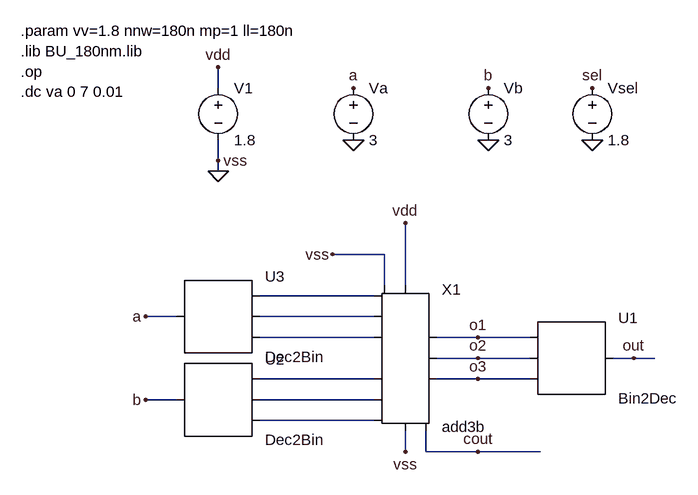
[diagram p0: schematic add3b_test.asc]
add3b_test.asc, the LTspice schematic file:
Version 4
SHEET 1 880 680
WIRE 144 -96 144 -128
WIRE 144 16 144 -16
WIRE 144 32 144 16
WIRE 400 160 320 160
WIRE 400 208 400 160
WIRE 432 208 432 112
WIRE 384 224 208 224
WIRE 80 256 32 256
WIRE 384 256 208 256
WIRE 384 288 208 288
WIRE 544 288 480 288
WIRE 624 288 544 288
WIRE 544 320 480 320
WIRE 624 320 544 320
WIRE 784 320 752 320
WIRE 816 320 784 320
WIRE 384 352 208 352
WIRE 544 352 480 352
WIRE 624 352 544 352
WIRE 80 384 32 384
WIRE 384 384 208 384
WIRE 384 416 208 416
WIRE 432 464 432 432
WIRE 464 464 464 432
WIRE 544 464 464 464
WIRE 640 464 544 464
FLAG 784 320 out
FLAG 144 32 0
FLAG 352 -16 0
FLAG 560 -16 0
FLAG 144 16 vss
FLAG 352 -96 a
FLAG 560 -96 b
FLAG 32 256 a
FLAG 32 384 b
FLAG 720 -16 0
FLAG 720 -96 sel
FLAG 544 352 o3
FLAG 544 320 o2
FLAG 544 288 o1
FLAG 544 464 cout
FLAG 144 -128 vdd
FLAG 432 464 vss
FLAG 320 160 vss
FLAG 432 112 vdd
SYMBOL Bin2Dec 688 320 R0
SYMATTR InstName U1
SYMATTR SpiceLine Vhigh={vv}
SYMBOL Dec2Bin 144 384 R0
SYMATTR InstName U2
SYMATTR SpiceLine Vhigh={vv}
SYMBOL Dec2Bin 144 256 R0
SYMATTR InstName U3
SYMATTR SpiceLine Vhigh={vv}
SYMBOL /voltage 144 -112 R0
SYMATTR InstName V1
SYMATTR Value 1.8
SYMBOL /voltage 352 -112 R0
SYMATTR InstName Va
SYMATTR Value 3
SYMBOL /voltage 560 -112 R0
SYMATTR InstName Vb
SYMATTR Value 3
SYMBOL /voltage 720 -112 R0
SYMATTR InstName Vsel
SYMATTR Value 1.8
SYMBOL add3b 432 320 R0
SYMATTR InstName X1
SYMATTR SpiceLine ll={ll} wn={nnw} wp={nnw*mp}
TEXT -160 -184 Left 2 !.param vv=1.8 nnw=180n mp=1 ll=180n\n.lib BU_180nm.lib\n.op\n.dc va 0 7 0.01

The netlist it stands for:
* add3b_test.asc
XU1 o1 o2 o3 out Bin2Dec Vhigh={vv}
XU2 b N004 N005 N006 Dec2Bin Vhigh={vv}
XU3 a N001 N002 N003 Dec2Bin Vhigh={vv}
V1 vdd 0 1.8
Va a 0 3
Vb b 0 3
Vsel sel 0 1.8
XX1 vdd N001 N002 N003 N004 N005 N006 0 o1 o2 o3 cout 0 add3b params: ll={ll} wn={nnw} wp={nnw*mp}
.param vv=1.8 nnw=180n mp=1 ll=180n
.lib BU_180nm.lib
.op
.dc va 0 7 0.01
.lib BIN2DEC.sub
.lib DEC2BIN.sub
.backanno
.end

* Results of the author's LTspice run, read from the files saved beside the schematic
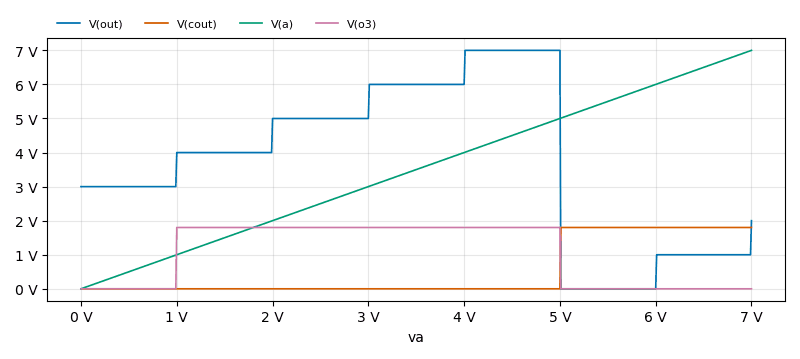
[diagram p1: DC transfer characteristic of add3b_test.asc, plotted from the saved traces]
* DC transfer characteristic, 1 run:
*   V(out): 3 V at va=0 V, 2 V at va=7 V, min 0 V, max 7 V
*   V(cout): 1.127 µV at va=0 V, 1.8 V at va=7 V, min 1.127 µV, max 1.8 V
*   V(a): 0 V at va=0 V, 7 V at va=7 V, min 0 V, max 7 V
*   V(o3): 2.037 µV at va=0 V, 2.24 µV at va=7 V, min 2.037 µV, max 1.8 V